# Altium schematic sheet power.SchDoc
size A4; SheetNumber: 5; SheetTotal: 5; SPICEModelCacheDFOVHANC: <root> / <DocumentId>DFOVHANC</DocumentId> / <CacheFrame Number="0"> / <Model Name="tlv70231_s1" Kind="CKT"> / <Text>*$ / .subckt TLV70231_S1 1 2 3 4 / S_S1         3 4 1 2 _S1 / RS_S1         1 2 1G / .MODEL         _S1 VSWITCH Roff=1e3 Ron=100 Voff=0.0V Von=1 / .ends TLV70231_S1</Text> / </Model> / <Model Name="tlv70231_f1" Kind="CKT"> / <Text>*$ / .subckt TLV70231_F1 1 2 3 4 / F_F1         3 4 VF_F1 1 / VF_F1         1 2 0V / .ends TLV70231_F1</Text> / </Model> / <Model Name="d_d" Kind="CKT"> / <Text>*$ / .subckt d_d 1 2 / d1 1 2 dd / .model dd d / + is=1e-015 / + n=0.01 / + tt=1e-011 / .ends d_d</Text> / </Model> / <Model Name="tlv70231_s6" Kind="CKT"> / <Text>*$ / .subckt TLV70231_S6 1 2 3 4 / S_S6         3 4 1 2 _S6 / RS_S6         1 2 1G / .MODEL         _S6 VSWITCH Roff=1e6 Ron=1m Voff=0.1 Von=0.9 / .ends TLV70231_S6</Text> / </Model> / <Model Name="comphys_basic_gen" Kind="CKT"> / <Text>*$ / *********************************/////////// / .SUBCKT COMPHYS_BASIC_GEN INP INM HYS OUT PARAMS: VDD=1 VSS=0 VTHRESH=0.5 / EIN INP1 INM1 INP INM 1 / EHYS INP1 INP2 VALUE { IF( V(1) &gt; {VTHRESH},-V(HYS),0) } / EOUT OUT 0 VALUE { IF( V(INP2)&gt;V(INM1), {VDD} ,{VSS}) } / R1 OUT 1 1 / C1 1 0 5n / RINP1 INP1 0 1K / .ENDS COMPHYS_BASIC_GEN</Text> / </Model> / <Model Name="tlv70231_h1" Kind="CKT"> / <Text>*$ / .subckt TLV70231_H1 1 2 3 4 / H_H1         3 4 VH_H1 1 / VH_H1         1 2 0V / .ends TLV70231_H1</Text> / </Model> / <Model Name="tlv70231_trans" Kind="CKT"> / <Text>*$ / * TLV70231 &amp; TLV702-Q1(3.1V) / ***************************************************************************** / * (C) Copyright 2017, 2011 Texas Instruments Incorporated. All rights reserved. / ***************************************************************************** / ** This model is designed as an aid for customers of Texas Instruments. / ** TI and its licensors and suppliers make no warranties, either expressed / ** or implied, with respect to this model, including the warranties of / ** merchantability or fitness for a particular purpose. The model is / ** provided solely on an "as is" basis. The entire risk as to its quality / ** and performance is with the customer. / ***************************************************************************** / * / * This model is subject to change without notice. Texas Instruments / * Incorporated is not responsible for updating this model. / * / ***************************************************************************** / ** Released by: WEBENCH Design Center, Texas Instruments Inc. / * Part: TLV70231 &amp; TLV702-Q1(3.1V) / * Date: 07APR2017 / * Model Type: Transient / * Simulator: PSPICE / * Simulator Version: 16.2.0.p001 / * EVM Order Number: / * EVM Users Guide: / * Datasheet: TLV702-SLVSAG6C -SEPTEMBER 2010-REVISED MARCH 2015 / *            TLV702Q1-SLVSC35B -AUGUST 2013-REVISED JUNE 2015 / * / * Model Version: Final 1.10 / * / ***************************************************************************** / * / * Updates: / * / * Final 1.10 / * Release to Web / * &lt;Made below changes to the model&gt; / * 1. Associated project file TLV702 with TLV702-Q1. / * 2. Output is isolated with input when EN voltage goes to zero. / * 3. Dropout is made dependent on input voltage. / * / * Final 1.00 / * Release to Web / * / ***************************************************************************** / * / * Model Usage Notes: / * / * 1. The following features have been modeled / *      a. Start-up time / *      b. PSSR / *      c. Enable/VIN shutdown / *      d. Load and line regulation / *      e. Load and line transients / *      f. Internal current limit / * / * 2. Temperature effects &amp; Ground/shutdown/quiescent pin current have not been modeled / ************************************************************************************** / .SUBCKT TLV70231_TRANS IN EN OUT GND NC / R_R3         GND FB  1.0E6 / R_R10         0 NC  100MEG TC=0,0 / E_E14         VZZ_INT 0 VALUE { V(VZZ, GND) } / X_F1    VZZ VOUT_INT N15505691 VYY TLV70231_F1 / R_R11         EN GND  1E6 TC=0,0 / R_R4         FB N15505647  2.1E6 / X_S6    EN_OK 0 N15505647 OUT TLV70231_S6 / V_V1         IN N15577606 0Vdc / C_U1_C3         GND N15505751  1N / V_U1_V7         U1_N154966513 0 0.5Vdc / E_U1_ABM6         U1_N15488677 0 VALUE { IF(V(UV_OK)&gt; 0.6 &amp; V(EN_OK) &gt; 0.6, / + {VREF}, 0)    } / E_U1_E3         U1_DROP_INT 0 TABLE { V(VIN_PRE, 0) } / + ( (2.25, 254m)(2.47, 240m)(2.75, 222m)(2.97, 213m)(3.25, / +  200m)(4,200m)(4.7,200m)(4.8, 200m) ) / R_U1_R3         U1_N15488677 U1_N15488381  {3.333e5*SQRT(TTRN)} TC=0,0 / C_U1_C1         0 U1_N15488381  {1e-6*SQRT(TTRN)} / E_U1_ABM8         U1_DROP 0 VALUE { (V(ISENSE) * V(U1_DROP_INT)/300m)    } / X_U1_U1         EN_INT U1_N15496735 U1_N154966513 EN_OK COMPHYS_BASIC_GEN / +  PARAMS: VDD=1 VSS=0 VTHRESH=0.5 / X_U1_U2         VIN_PRE U1_N15502244 U1_N154889573 UV_OK COMPHYS_BASIC_GEN / +  PARAMS: VDD=1 VSS=0 VTHRESH=0.5 / E_U1_E4         U1_N15488841 GND VALUE { V(U1_N15847160, 0) } / R_U1_R4         U1_N15488775 U1_N15488397  1 TC=0,0 / R_U1_R2         GND U1_N15488397  1G / C_U1_C2         0 U1_N15488397  1n / V_U1_V3         U1_N154889573 0 {UHYS} / E_U1_ABM5         U1_N15847160 0 VALUE { MIN(V(U1_N15488397), / + MAX(V(VIN_PRE) - V(U1_DROP), 0))   } / R_U1_R5         U1_N15488841 N15505751  10 TC=0,0 / V_U1_V4         U1_N15502244 0 {UVLO} / E_U1_ABM4         U1_N15488775 0 VALUE { V(U1_N15488381) / + * (ABS(V(N15506031)) + 1e-6) / + / (ABS(V(V_FBK)) + 1e-6)  } / V_U1_V6         U1_N15496735 0 {VEN} / R_U1_R1         GND U1_N15488381  1G / E_E12         N15505939 0 VALUE { V(VXX, GND) } / E_E5         EN_INT 0 VALUE { V(EN, GND) } / R_R9         0 NC  100MEG TC=0,0 / E_E11         V_FBK 0 VALUE { V(FB, GND) } / R_R1         VXX N15505691  {RINP} / X_H1    VOUT_INT N15505647 ISENSE 0 TLV70231_H1 / E_ABM1         N15571492 0 VALUE { MIN(V(N15505939), (V(Vzz_INT)+(ILIM*ROUT))) / +    } / R_R2         N15505751 VXX  {PSRR*RINP} / X_U2         OUT N15609054 d_d / C_C1         VXX N15505691  {1/(6.28*RINP*POLE)} / R_R6         N15571917 VYY  1 TC=0,0 / R_R12         IN N15609054  0.1 TC=0,0 / C_C2         VXX N15505751  {1/(6.28*PSRR*RINP*ZERO)} / X_S1    EN_OK 0 N15577606 N15505691 TLV70231_S1 / E_E6         VIN_PRE 0 VALUE { V(IN, GND) } / E_E13         N15571917 GND VALUE { V(N15571492, 0) } / R_R5         VZZ VYY  {ROUT} / E_E15         N15506031 0 VALUE { V(VOUT_INT, GND) } / C_C3         VYY GND  1n / C_C4         GND N15505691  1n  TC=0,0 / .PARAM  psrr=398.1u uvlo=1.9 ilim=500ma ven=0.9v pole=15k zero=200k rinp=1e6 / +  ttrn=72.5u rout=1m vref=1.0v uhys=100mv / .ENDS TLV70231_TRANS</Text> / <Dependency>0\tlv70231_s1</Dependency> / <Dependency>0\tlv70231_f1</Dependency> / <Dependency>0\d_d</Dependency> / <Dependency>0\tlv70231_s6</Dependency> / <Dependency>0\comphys_basic_gen</Dependency> / <Dependency>0\tlv70231_h1</Dependency> / </Model> / </CacheFrame> / </root>
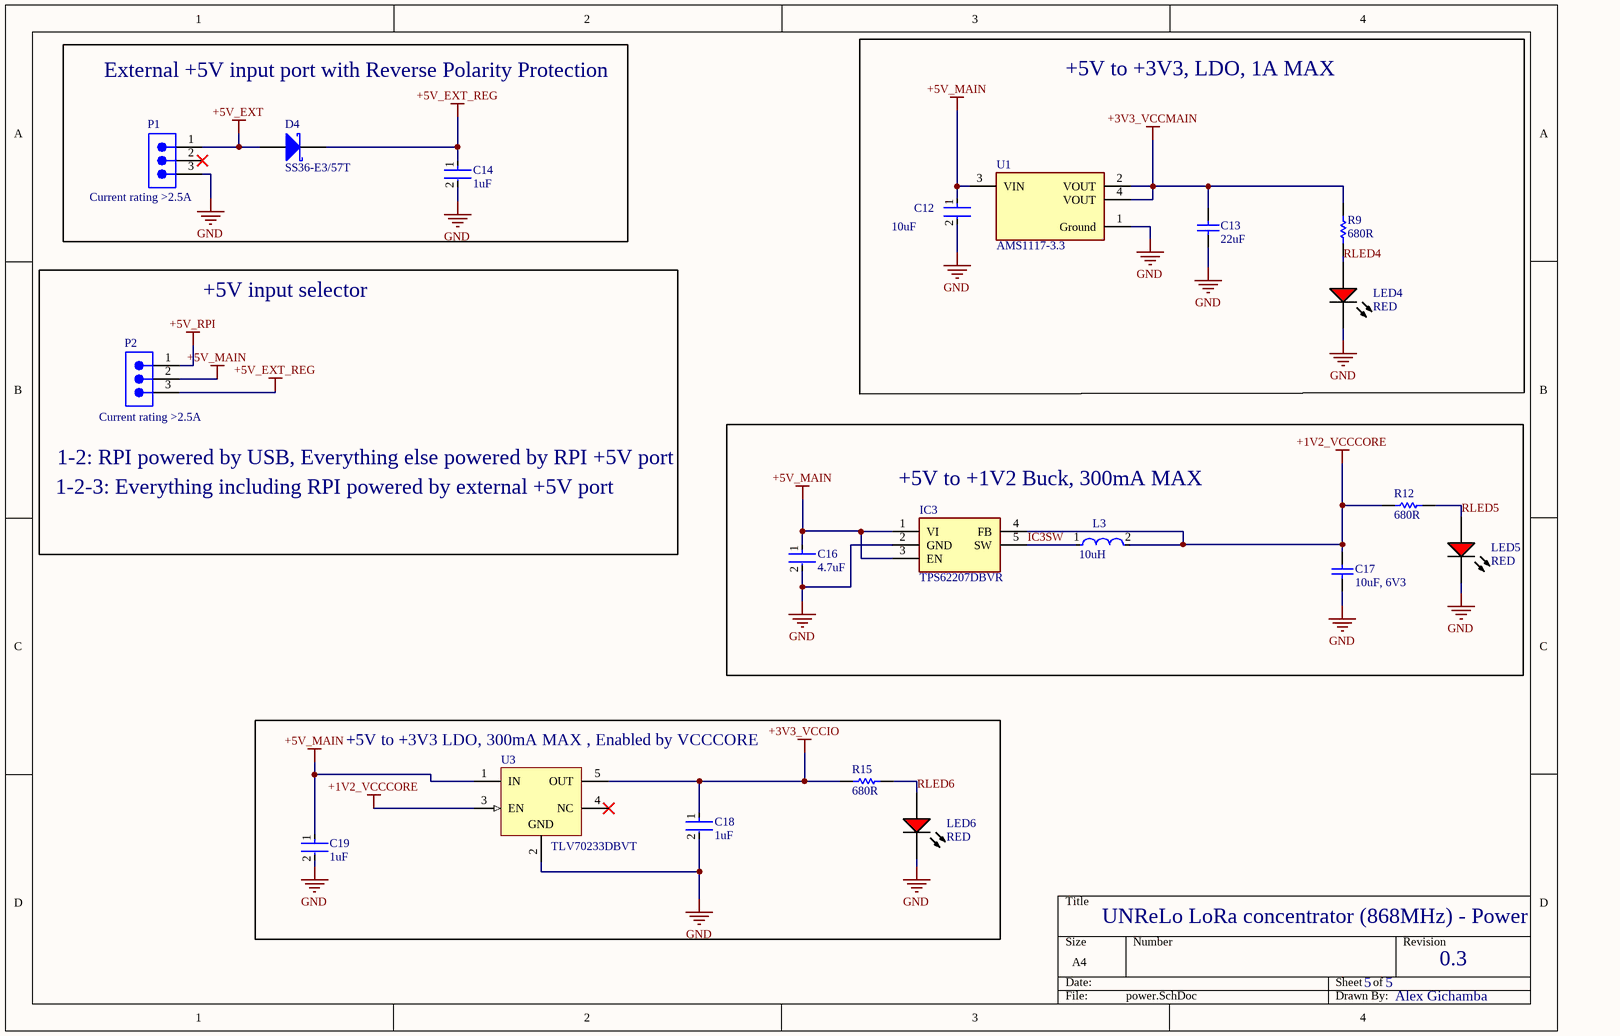
[diagram p0: power.SchDoc]

## Parts
C12  10uF  [FP-CL10-IPC_A]
C13  22uF  [CAPC2013X140X45LL15T25]
C14  1uF  [FP-CL21-IPC_A]
C16  4.7uF  [FP-CL21-IPC_A]
C17  10uF, 6V3  [CAPC2013X95X50LL10T25]
C18  1uF  [FP-CL21-IPC_A]
C19  1uF  [FP-CL21-IPC_A]
D4  SS36-E3/57T  [VISH-DO-214AB-2_V]
IC3  TPS62207DBVR  [SOT95P280X145-5N]
L3  10uH  [FP-LQH43CN_03-MFG]
LED4  RED  [LTST-C170KRKT_V]
LED5  RED  [LTST-C170KRKT_V]
LED6  RED  [LTST-C170KRKT_V]
P1  Current rating >2.5A  [SMTC-TSW-103-07-X-S]
P2  Current rating >2.5A  [SMTC-TSW-103-07-X-S]
R9  680R  [RESC2013X70X40ML20T20]
R12  680R  [RESC2013X70X40ML20T20]
R15  680R  [RESC2013X70X40ML20T20]
U1  AMS1117-3.3  [FP-AMS1117-IPC_C]
U3  TLV70233DBVT  [DBV0005A_N]

## Blocks framed on the sheet
+5V to +3V3, LDO, 1A MAX: C12 C13 LED4 R9 U1
+5V to +1V2 Buck, 300mA MAX: C16 C17 IC3 L3 LED5 R12
+5V to +3V3 LDO, 300mA MAX , Enabled by VCCCORE: C18 C19 LED6 R15 U3

## Nets
+1V2_VCCCORE: C17.1 IC3.4(FB) L3.2 R12.2 U3.3(EN)
+3V3_VCCIO: C18.1 R15.2 U3.5(OUT)
+3V3_VCCMAIN: C13.2 R9.2 U1.2(VOUT) U1.4(VOUT)
+5V_EXT: D4.1(A) P1.1
+5V_EXT_REG: C14.1 D4.2(K) P2.3
+5V_MAIN: C12.1 C16.1 C19.1 IC3.1(VI) IC3.3(EN) P2.2 U1.3(VIN) U3.1(IN)
+5V_RPI: P2.1
GND: C12.2 C13.1 C14.2 C16.2 C17.2 C18.2 C19.2 IC3.2(GND) LED4.2(K) LED5.2(K) LED6.2(K) P1.3 U1.1(Ground) U3.2(GND)
IC3SW: IC3.5(SW) L3.1
RLED4: LED4.1(A) R9.1
RLED5: LED5.1(A) R12.1
RLED6: LED6.1(A) R15.1

Not connected (* = marked no-connect by the designer): P1 2*; U3 4(NC)*

## Notes on the sheet
- External +5V input port with Reverse Polarity Protection
- +5V input selector
- 1-2-3: Everything including RPI powered by external +5V port
- 1-2: RPI powered by USB, Everything else powered by RPI +5V port
- UNReLo LoRa concentrator (868MHz) - Power
- 5
- 0.3
- Alex Gichamba

## Library data of the parts
C12 = CMP-13271-001938-1: Cap Ceramic 10uF 6.3V X5R ±20% Pad SMD 0603 +85°C T/R; Contact Plating: Tin; Height: 0.8mm; Width: 0.031inch; Min Operating Temperature: -55°C; Capacitance: 10uF; Dielectric: X5R; Voltage Rating: 6.3V; Case/Package: 0603; Package Quantity: 1; Radiation Hardening: No; Packaging: Tape and Reel; Max Operating Temperature: 85°C; Voltage: 6.3V; Thickness: 0.035inch; Mount: Surface Mount; Case Code (Imperial): 0603; Case Code (Metric): 1608; Depth: 0.8mm; Tolerance: 20%; Length: 1.6mm
C13 = CMP-2000-06104-1: Multi-layer Ceramic Capacitor, 22 uF, -55 to 85 degC, 2-Pin SMD (0805), RoHS, Tape and Reel; Manufacturer: Samsung Electro-Mechanics; Voltage - Rated: 25V; Other Names: 1276-2908-2; Capacitance: 22µF; Featured Product: Multi-LayerCeramicCapacitors; Product Training Modules: HighCapMLCCFamily; Temperature Coefficient: X5R; Tolerance: ±20%; Online Catalog: CLSeries,HighCapacitance; Applications: GeneralPurpose; RoHS Information: MLCCRoHS2Compliance; Height - Seated (Max): -; Lead Style: -; Lead Spacing: -; Datasheet URL: http://datasheet.octopart.com/CL21A226MAQNNNE-Samsung-datasheet-48647558.pdf; Size / Dimension: 0.079"Lx0.049"W(2.00mmx1.25mm); Thickness (Max): 0.055"(1.40mm); Family: CeramicCapacitors; Package Description: 2-Pin Surface Mount Device, Body 2.0 x 1.25 mm; Datasheet Version: 07/2015; Packaging: Tape&Reel(TR); Manufacturer URL: http://www.samsungsem.com/global/index.jsp; Ratings: -; Package / Case: 0805(2012Metric); Standard Package: 2,000; Mounting Type: SurfaceMount,MLCC; Mounting Technology: SurfaceMount; Category: Capacitors; Package Reference: 0805; Series: CL; Features: -; Operating Temperature: -55°C~85°C
C14 C18 C19 = CMP-13271-003098-1: CL21 Series 0805 1uF 16V ±10% Tolerance X7R Multilayer Ceramic Chip Capacitor; Case Code (Metric): 2012; Width: 0.049inch; Thickness: 0.053inch; Voltage Rating: 16V; Max Operating Temperature: 125°C; Case Code (Imperial): 0805; Height: 1.25mm; Length: 2mm; Case/Package: 0805; Lead Free: Lead Free; Mount: Surface Mount; Capacitance: 1uF; Tolerance: 10%; Voltage Rating (DC): 16V; Min Operating Temperature: -55°C; Contact Plating: Tin; Depth: 1.25mm; Packaging: Tape and Reel; Package Quantity: 1; Voltage: 16V; Dielectric: X7R; Radiation Hardening: No
C16 = CMP-13271-002624-1: CL21 Series 0805 4.7uF 25V ±10% Tolerance X5R Multilayer Ceramic Chip Capacitor; Case Code (Imperial): 0805; Thickness: 0.055inch; Mount: Surface Mount; Case Code (Metric): 2012; Capacitance: 4.7uF; Depth: 1.25mm; Lead Free: Lead Free; Case/Package: 0805; Voltage Rating: 25V; Package Quantity: 1; Width: 0.049inch; Radiation Hardening: No; Voltage Rating (DC): 25V; Length: 2mm; Dielectric: X5R; Height: 1.25mm; Packaging: Tape and Reel; Tolerance: 10%; Min Operating Temperature: -55°C; Max Operating Temperature: 85°C
C17 = CMP-2000-06497-1: Chip Capacitor, 10 uF, +/- 10%, 6.3 V, -55 to 85 degC, 0805 (2012 Metric), RoHS, Tape and Reel; Manufacturer: Taiyo Yuden; PCN Part Number: X5R,X7RDielectrics23/Jan/2008; Other Names: 587-1304-6; Capacitance: 10µF; Temperature Coefficient: X5R; Catalog Drawings: xMKSeries_0805_0.85; Voltage - Rated: 6.3V; Online Catalog: MSeries; Package Reference: 0805; Family: CeramicCapacitors; Packaging: Digi-Reel®; Thickness (Max): 0.037"(0.95mm); Ratings: -; Package / Case: 0805(2012Metric); Datasheet URL: http://www.yuden.co.jp/productdata/catalog/en/mlcc_all_e.pdf; Mounting Type: SurfaceMount,MLCC; Manufacturer URL: http://www.t-yuden.com/; Category: Capacitors; Applications: GeneralPurpose; Size / Dimension: 0.079"Lx0.049"W(2.00mmx1.25mm); Height - Seated (Max): -; Features: -; Lead Style: -; Lead Spacing: -; Standard Package: 1; Mounting Technology: SurfaceMount; Series: M; Operating Temperature: -55°C~85°C; Tolerance: ±10%; Datasheet Version: 09/2015; Package Description: 2-Pin Surface Mount Device, Body 2 x 1.25 mm
D4 = CMP-2000-07150-1: Surface Mount Schottky Barrier Rectifier, 60 V, 3 A, -55 to 150 degC, 2-Pin SMC (DO-214AB), RoHS, Tape and Reel; Manufacturer: Vishay; Forward Current If(AV): 3A; Diode Configuration: Single; Forward Surge Current Ifsm Max: 100A; SVHC: ToBeAdvised; No. of Pins: 2Pins; Forward Voltage VF Max: 750mV; Repetitive Reverse Voltage Vrrm Max: 60V; Datasheet URL: http://www.vishay.com/docs/88751/ss32.pdf; Datasheet Version: 08/2015; Manufacturer URL: http://www.vishay.com/; Diode Type: Schottky; Package Reference: DO-214AB; Mounting Technology: SurfaceMount; Diode Case Style: DO-214AB; Package Description: 2-Pin Surface Mount Device, Body 6.855 x 5.905 mm; Packaging: CutTape; Operating Temperature Max: 150°C; Product Range: -
IC3 = TPS62207DBVR: Integrated Circuit; Manufacturer_Name: Texas Instruments; Datasheet Link: http://www.ti.com/lit/gpn/TPS62207; Height: 1.45mm; Manufacturer_Part_Number: TPS62207DBVR; Mouser Part Number: 595-TPS62207DBVR; Mouser Price/Stock: https://www.mouser.co.uk/ProductDetail/Texas-Instruments/TPS62207DBVR?qs=Gse6rAGbi79aAmSVxgl2Vw%3D%3D; Arrow Part Number: TPS62207DBVR; Arrow Price/Stock: https://www.arrow.com/en/products/tps62207dbvr/texas-instruments
L3 = CMP-06042-000023-2: Wire Wound Ferrite Inductor for Power Lines For Automotive 10μH ±20% 0.1764Ω 1170mA 1812; Current Rating: 1.17A; Resistance: 24R; Max Power Dissipation: 30W; Test Frequency: 1MHz; Shielding: Shielded; Saturation Current: 1.05A; Temperature Coefficient: 100ppm/°C; Tolerance: 5%; Self Resonant Frequency: 20MHz; DC Resistance (DCR): 176.4mR; Resistor Type: Thick Film; Min Operating Temperature: -50°C; Number of Terminations: 2; Packaging: Rail/Tube; Inductance: 10uH; Ratings: AEC-Q200; Mount: Surface Mount; Max Operating Temperature: 150°C; Features: Automotive AEC-Q200; Core Material: Ferrite; Case/Package: TO-220-2
LED4-LED6 = CMP-2000-07593-1: LED Red, 75 mW, 54 mcd, -55 to 85 degC, 2-Pin SMD, RoHS, Tape and Reel; Manufacturer: Lite-On; Lens Transparency: Clear; Number of Elements: 1; Power Rating: 75mW; Luminous Intensity: 54mcd; Viewing Angle: 130degrees; Forward Current: 30mA; Wavelength: 639nm; Lens Style: Rectangular; Case\/Package: 0805; Test Current: 20mA; Dominant Wavelength: 631nm; Forward Voltage: 2V; Lens Colour: Colorless; Min Operating Temperature: -55degC; RoHSCompliant: True; Length: 3.2mm; Width: 1.25mm; Mount: SurfaceMount; Packaging: TapeandReel; Number of LEDs: 1; Radiation Hardening: No; Datasheet URL: http://optoelectronics.liteon.com/upload/download/DS-22-99-0150/LTST-C170KRKT.pdf; Datasheet Version: Rev. D, 11/2014; Case Code (Metric): 2012; Height: 1.1mm; Number of Pins: 2; Package Description: 2-Pin Surface Mount Device, Body 2 x 1.25 mm; Manufacturer URL: http://www.us.liteon.com/; Lead Free: LeadFree; Illumination Colour: Red; Colour: Red; Case Code (Imperial): 0805; Max Operating Temperature: 85degC; Power Dissipation: 75mW; Mounting Technology: SurfaceMount; Package Reference: C170KRKT; Package Quantity: 1; Depth: 1.6mm
P1 P2 = CMP-1024-00332-1: 0.025" SQ Post Header, Through-hole, Vertical, -55 to 105 degC, 2.54 mm Pitch, 3-Pin, Male, RoHS; PartNumber: TSW-103-07-T-S; Manufacturer: Samtec; Pitch: 2.54 mm; ComponentLink1URL: http://www.samtec.com; ComponentLink3URL: http://www.samtec.com/documents/webfiles/cpdf/TSW-XXX-XX-XXX-X-XX-XXX-MKT.pdf; Mounting Technology: Through-hole; RoHS: True; DatasheetVersion: F-214; PackageVersion: DM, 8/1988; Temperature Range: -55 to 105 degC; ComponentLink2Description: Datasheet; ComponentLink1Description: Manufacturer URL; Orientation: Vertical; PackageReference: TSW-103-07-X-S; ComponentLink3Description: Package Specification; ComponentLink2URL: http://www.samtec.com/documents/webfiles/pdf/TSW_TH.PDF; PackageDescription: .025[0.64] SQ. Post Terminal Strip Assembly
R9 R12 R15 = CMP-2001-00566-1: Part Number: ERJ6ENF6800V; Manufacturer: Panasonic
U1 = CMP-209535-000001-1: LDO Voltage Regulators 1A, 3.3V; Manufacturer: Advanced Monolithic Systems; Dropout Voltage: 1.1V; Output Type: Fixed; Nominal Supply Current: 5mA; Max Power Dissipation: 1.2W; Max Supply Voltage: 15V; Number Of Outputs: 1; Standoff Height: 0.64mm; Max Junction Temp: +125°C; Height: 1.8mm; Package: AMS1117; Device Class L2: Power Management ICs; ComponentLink2Description: Datasheet; ComponentLink2URL: http://www.advanced-monolithic.com/pdf/ds1117.pdf; Category: IC; RoHS: TRUE; Automotive: No; Device Class L1: Integrated Circuits (ICs); Output Current: 1A; Device Class L3: Voltage Regulators - Linear; Temperature: -40°C to +125°C; Output Voltage: 3.3V; Manufacturer Part Number: AMS1117-3.3; Temperature Range Low: -40°C; Octopart: https://octopart.com/ams1117-3.3-advanced+monolithic+systems-25899300; Lead Free: Yes; Ipc Land Pattern Name: SOT229P700X180-4; Temperature Range High: +125°C
U3 = CMP-0394-00524-3: None; Max Output Voltage: 3.3V; Min Input Voltage: 2V; Quiescent Current: 30uA; Accuracy: 2%; Number of Outputs: 1; Power Dissipation: 500mW; Dropout Voltage: 220mV; Output Voltage Accuracy: 0.5%; Max Output Current: 300mA; Polarity: Positive; Power Supply Rejection Ratio (PSRR): 68dB; Output Type: Fixed; Max Input Voltage: 5.5V; Min Current Limit: 320mA; REACH SVHC: No SVHC; RoHS Compliant: Yes; Length: 3.05mm; Radiation Hardening: No; Lead Free: Lead Free; Height: 1.45mm; Output Voltage: 3.3V; Min Operating Temperature: -40°C; Package Quantity: 1; Width: 1.75mm; Number of Regulators: 1; Case/Package: SOT-23; Number of Pins: 5; Output Current: 300mA; Packaging: Tape and Reel; Min Output Voltage: 3.3V; Max Operating Temperature: 125°C; Series: -; Nominal Output Voltage: 3.3V; Max Power Dissipation: 500mW